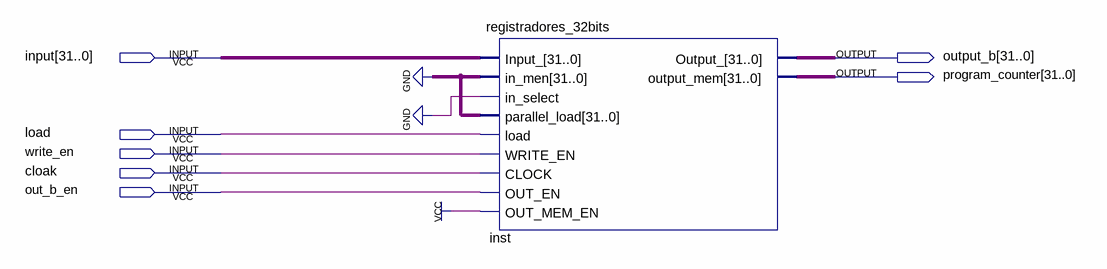
[diagram p0: schematic sheet]
// Quartus schematic PC.bdf as structural Verilog: 1 symbols, 7 pins
module PC (
  input  [31:0] \input ,
  input  load,
  input  write_en,
  input  cloak,
  input  out_b_en,
  output [31:0] output_b,
  output [31:0] program_counter
);

  registradores_32bits inst (
    .Input_(\input ), .in_men({32{1'b0}}), .in_select(1'b0), .parallel_load({32{1'b0}}), .load(load),
    .WRITE_EN(write_en), .CLOCK(cloak), .OUT_EN(out_b_en), .OUT_MEM_EN(1'b1), .Output_(output_b),
    .output_mem(program_counter));
endmodule
